# EAGLE design bp1 (EAGLE 6.5.0)
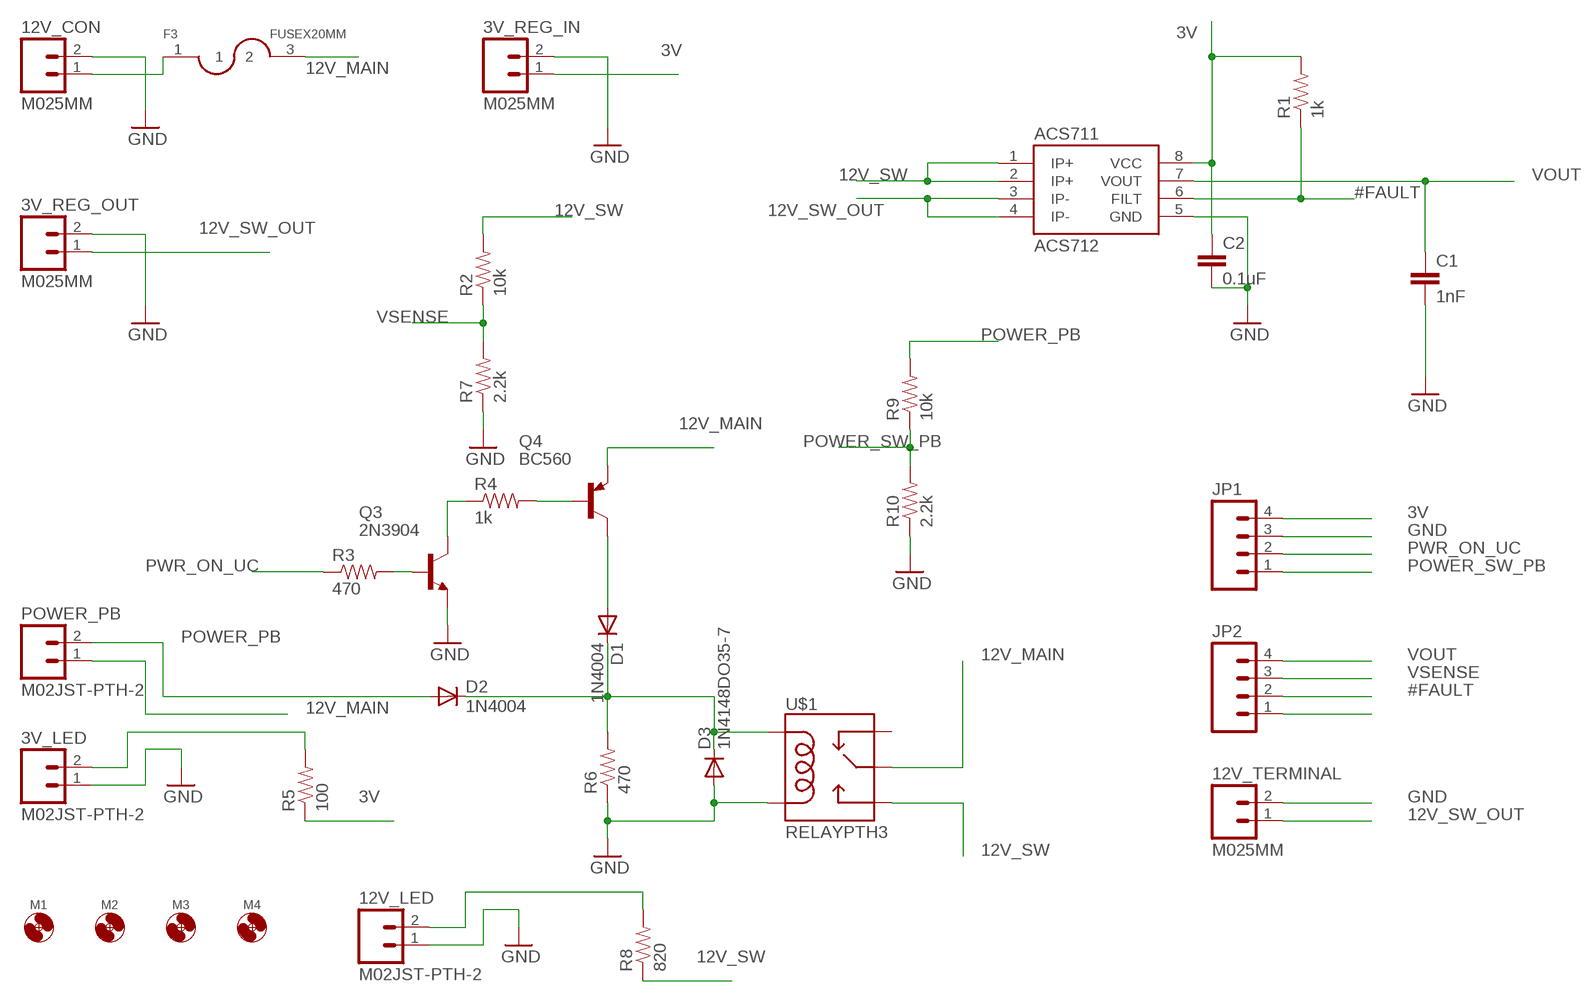
[diagram p0: schematic, sheet 1]

## Parts
3V_LED  M02JST-PTH-2  [JST-2-PTH]
3V_REG_IN  M025MM  [SCREWTERMINAL-5MM-2]
3V_REG_OUT  M025MM  [SCREWTERMINAL-5MM-2]
12V_CON  M025MM  [SCREWTERMINAL-5MM-2]
12V_LED  M02JST-PTH-2  [JST-2-PTH]
12V_TERMINAL  M025MM  [SCREWTERMINAL-5MM-2]
ACS711  ACS712  [SO08]
C1  1nF  CAPKIT  [CAP-PTH-SMALL-KIT]
C2  0.1uF  CAPKIT  [CAP-PTH-SMALL-KIT]
D1  1N4004  [DO41-10]
D2  1N4004  [DO41-10]
D3  1N4148DO35-7  [DO35-7]
F3  FUSEX20MM  [FUSE_5MM]
JP1  M04POLAR  [MOLEX-1X4]
JP2  M04POLAR  [MOLEX-1X4]
M1  MOUNT-HOLE3.0  [3,0]
M2  MOUNT-HOLE3.0  [3,0]
M3  MOUNT-HOLE3.0  [3,0]
M4  MOUNT-HOLE3.0  [3,0]
POWER_PB  M02JST-PTH-2  [JST-2-PTH]
Q3  2N3904  [TO92]
Q4  BC560  [TO92-EBC]
R1  1k  RESISTORPTH-1/4W  [AXIAL-0.4]
R2  10k  RESISTORPTH-1/4W  [AXIAL-0.4]
R3  470  RESISTORPTH-1/4W  [AXIAL-0.4]
R4  1k  RESISTORPTH-1/4W  [AXIAL-0.4]
R5  100  RESISTORPTH-1/4W  [AXIAL-0.4]
R6  470  RESISTORPTH-1/4W  [AXIAL-0.4]
R7  2.2k  RESISTORPTH-1/4W  [AXIAL-0.4]
R8  820  RESISTORPTH-1/4W  [AXIAL-0.4]
R9  10k  RESISTORPTH-1/4W  [AXIAL-0.4]
R10  2.2k  RESISTORPTH-1/4W  [AXIAL-0.4]
U$1  RELAYPTH3  [RELAY-T9A-2]

## Nets
3V: 3V_REG_IN.1 ACS711.8(VCC) C2.1 JP1.4 R1.P$2 R5.P$1
12V_MAIN: F3.3 POWER_PB.1 Q4.E U$1.MAIN
12V_SW: ACS711.1(IP+) ACS711.2(IP+) R2.P$2 R8.P$1 U$1.NO
12V_SW_OUT: 3V_REG_OUT.1 12V_TERMINAL.1 ACS711.3(IP-) ACS711.4(IP-)
#FAULT: ACS711.6(FILT) JP2.2 R1.P$1
GND: 3V_LED.1 3V_REG_IN.2 3V_REG_OUT.2 12V_CON.2 12V_LED.1 12V_TERMINAL.2 ACS711.5(GND) C1.2 C2.2 D3.A JP1.3 Q3.3(E) R6.P$1 R7.P$1 R10.P$1 U$1.COIL2
N$1: 12V_LED.2 R8.P$2
N$2: 12V_CON.1 F3.1
N$9: Q3.1(C) R4.P$1
N$10: Q4.B R4.P$2
N$11: Q3.2(B) R3.P$2
N$12: D1.A Q4.C
N$13: D1.C D2.C D3.C R6.P$2 U$1.COIL1
N$15: 3V_LED.2 R5.P$2
N$16: JP2.1
POWER_PB: D2.A POWER_PB.2 R9.P$2
POWER_SW_PB: JP1.1 R9.P$1 R10.P$2
PWR_ON_UC: JP1.2 R3.P$1
VOUT: ACS711.7(VOUT) C1.1 JP2.4
VSENSE: JP2.3 R2.P$1 R7.P$2
Unconnected: U$1.NC

## Library data of the parts
3V_LED 12V_LED POWER_PB = SparkFun-Connectors:M02: Standard 2-pin 0.1" header. Use with - straight break away headers ( PRT-00116) - right angle break away headers (PRT-00553) - swiss pins (PRT-00743) - machine pins (PRT-00117) - female headers (PRT-00115) Molex polarized connector foot print use with: PRT-08233 with associated crimp pins and housings. 2.54_SCREWTERM for use with PRT-10571. 3.5mm Screw Terminal footprints for PRT-08084 5mm Screw Terminal footprints for use with PRT-08433; SKU: PRT-09914
3V_REG_IN 3V_REG_OUT 12V_CON 12V_TERMINAL = SparkFun-Connectors:M02: Standard 2-pin 0.1" header. Use with - straight break away headers ( PRT-00116) - right angle break away headers (PRT-00553) - swiss pins (PRT-00743) - machine pins (PRT-00117) - female headers (PRT-00115) Molex polarized connector foot print use with: PRT-08233 with associated crimp pins and housings. 2.54_SCREWTERM for use with PRT-10571. 3.5mm Screw Terminal footprints for PRT-08084 5mm Screw Terminal footprints for use with PRT-08433
ACS711 = SparkFun-AnalogIC:ACS712: Hall-effect-based isolated linear current sensor
C1 C2 = SparkFun-Capacitors:CAP: Capacitor Standard 0603 ceramic capacitor, and 0.1" leaded capacitor.
D1 D2 = diode:1N4004: DIODE general purpose rectifier, 1 A
D3 = diode:1N4148: DIODE high speed (Philips)
F3 = SparkFun-Passives:FUSE
JP1 JP2 = SparkFun-Connectors:M04: Header 4 Standard 4-pin 0.1" header. Use with straight break away headers (SKU : PRT-00116), right angle break away headers (PRT-00553), swiss pins (PRT-00743), machine pins (PRT-00117), and female headers (PRT-00115). Molex polarized connector foot print use with SKU : PRT-08231 with associated crimp pins and housings. 1MM SMD Version SKU: PRT-10208
M1-M4 = PowerBoard:MOUNT-HOLE: MOUNTING HOLE with drill center marker
Q3 = transistor-npn:2N3904: NPN Transistor
Q4 = transistor-pnp:BC560*: PNP Transistror
R1-R10 = SparkFun-Passives:RESISTOR: Resistor Basic schematic elements and footprints for 0603, 1206, and PTH resistors.
U$1 = SparkFun-Electromechanical:RELAY: SPDT relay (COM-00101)

## Board
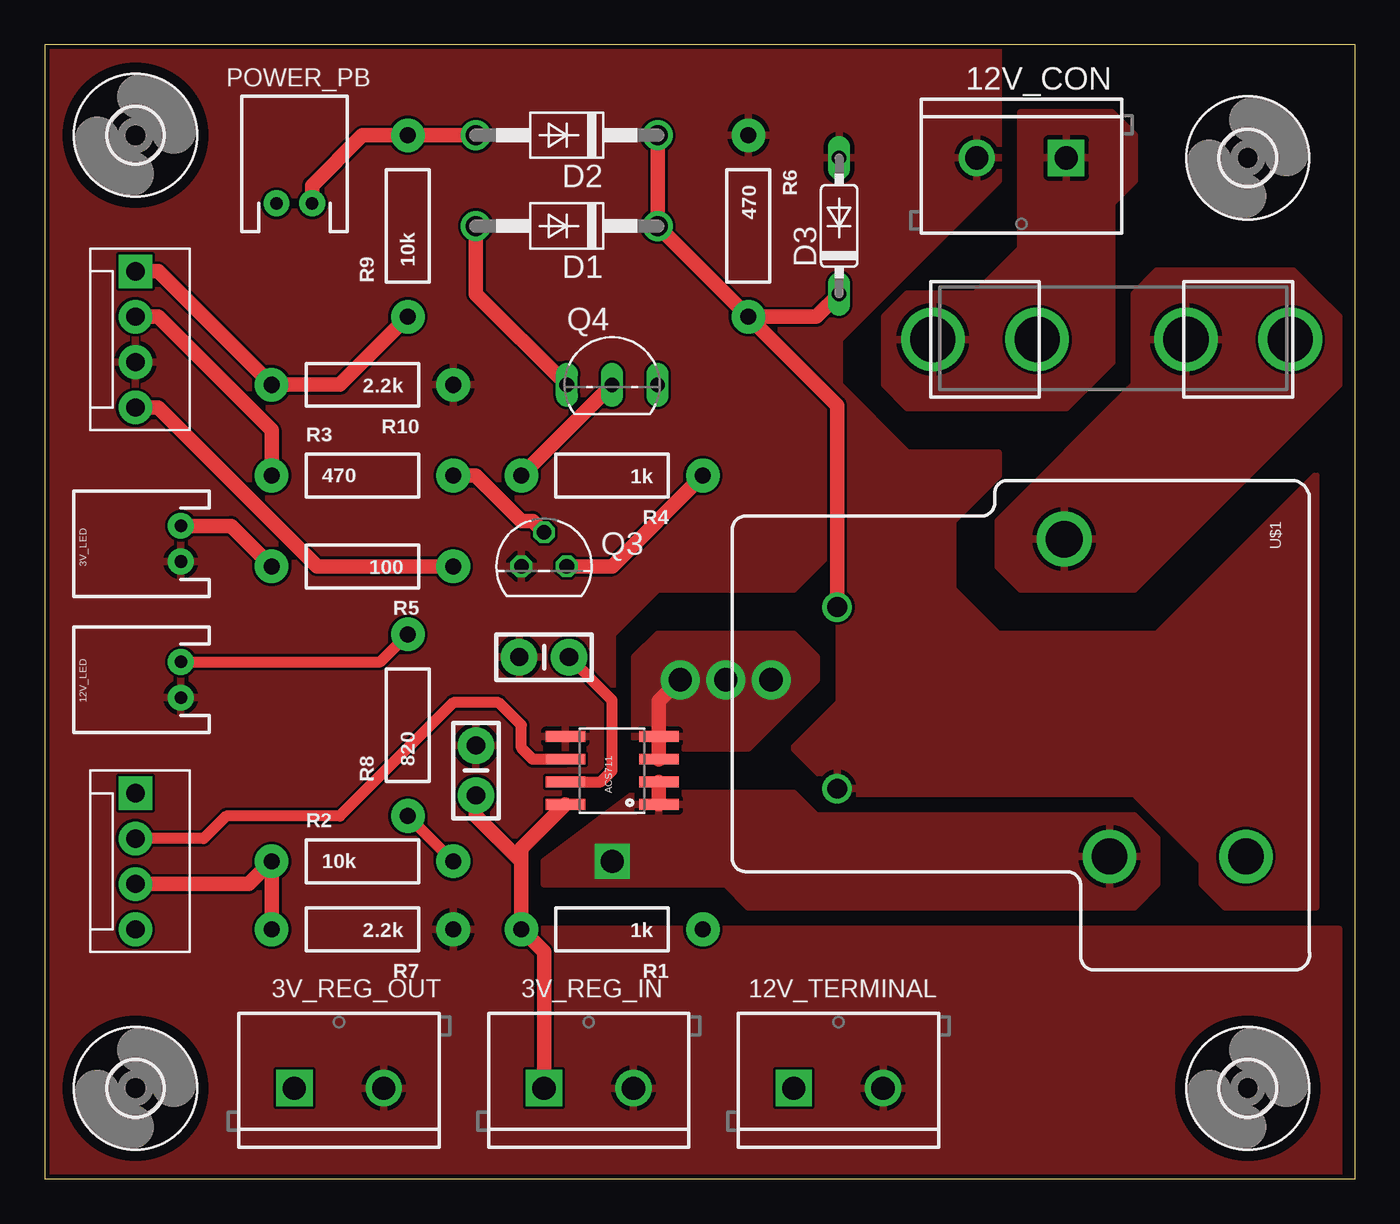
[diagram p1: board, top side]
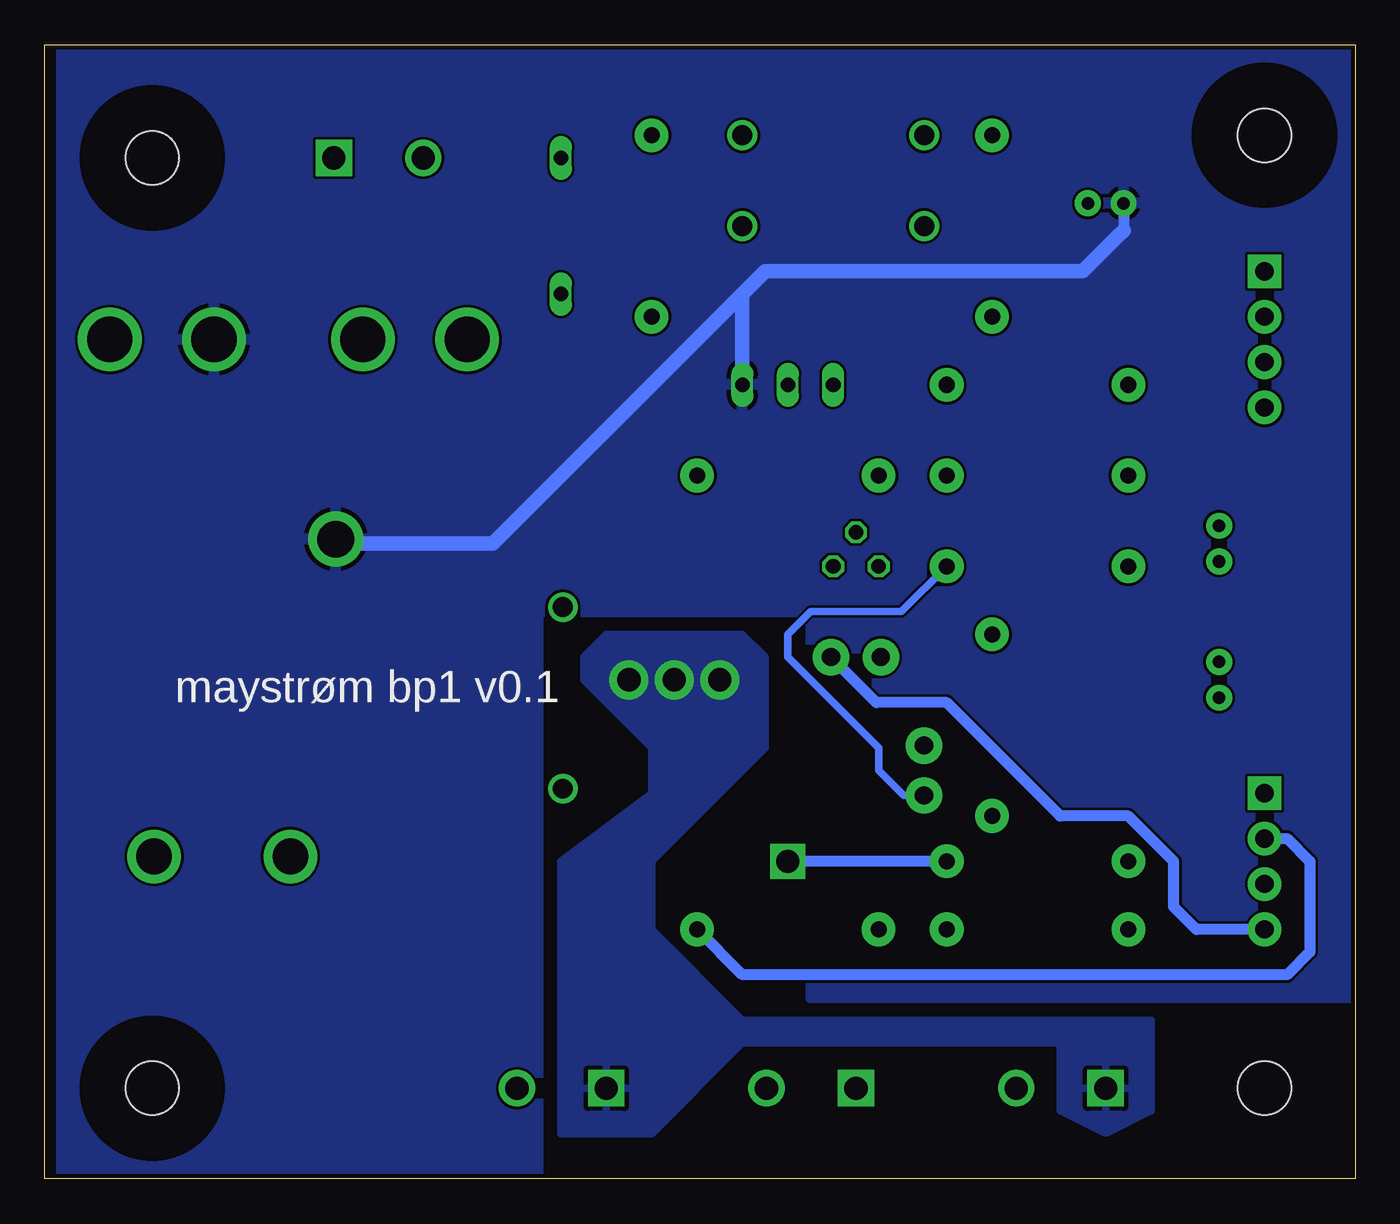
[diagram p2: board, bottom side, seen from below]

Size 73.33 x 63.49 mm. Coordinates in mm from the lower left corner, seen from the top.
Outline: 0,0 73.33,0 73.33,63.49 0,63.49 0,0
Copper layers (1*2*15*16): Top 0.035mm / dielectric 0.2mm / layer 2 0.0175mm / dielectric 1.1mm / layer 15 0.0175mm / dielectric 0.2mm / Bottom 0.035mm
Design rules "SeeedStudio_DRU_no_angle_20130527": minimum track width 6mil, minimum drill 12mil, track to track 6mil, track to pad 6mil, pad to pad 6mil, via to via 6mil, smd to smd 0mil, copper to edge 10mil, drill to drill 10mil, minimum pad ring 6mil, minimum via ring 6mil, stop-mask expansion 2mil, vias tented up to drill 25mil, thermal gap 10mil

### Footprints (pad centres in the part's own frame; a part is rotated, then mirrored left to right if it is on the bottom)
JST-2-PTH = drill 0.7 pad 1.448: 1 -1,0; 2 1,0
SCREWTERMINAL-5MM-2 = drill 1.3 pad 2.032 square: 1 0,0 | drill 1.3 pad 2.032: 2 5,0
SO08 = smd 0.61 x 2.21: 1 -1.905,-2.616; 2 -0.635,-2.616; 3 0.635,-2.616; 4 1.905,-2.616; 5 1.905,2.616; 6 0.635,2.616; 7 -0.635,2.616; 8 -1.905,2.616
CAP-PTH-SMALL-KIT = drill 1.016 pad 2.032: 1 -1.397,0; 2 1.397,0
DO41-10 = drill 1.118: A 5.08,0; C -5.08,0
DO35-7 = drill 0.813 long: A 3.81,0; C -3.81,0
FUSE_5MM = drill 2.54 pad 3.556: 1 0,-10; 2 0,-4.158; 3 0,4.158; 4 0,10
MOLEX-1X4 = drill 1.016 pad 1.88 square: 1 0,0 | drill 1.016 pad 1.88: 2 2.54,0; 3 5.08,0; 4 7.62,0
3,0 = hole 3: 0,0
TO92 = drill 0.813 octagon: 1 1.27,0; 2 0,1.905; 3 -1.27,0
TO92-EBC = drill 0.813 long: B 0,-1.27; C -2.54,-1.27; E 2.54,-1.27
AXIAL-0.4 = drill 0.9 pad 1.88: P$1 -5.08,0; P$2 5.08,0
RELAY-T9A-2 = drill 1.1: COIL1 -6.61,-10.27; COIL2 3.55,-10.27 | drill 2.057: MAIN -10.41,2.43 | drill 2: NC 7.35,12.6; NO 7.35,4.97

### Placement (x,y rotation side)
3V_LED  7.62,35.56 90 top
3V_REG_IN  27.94,5.08 0 top
3V_REG_OUT  13.97,5.08 0 top
12V_CON  57.15,57.15 180 top
12V_LED  7.62,27.94 90 top
12V_TERMINAL  41.91,5.08 0 top
ACS711  31.75,22.86 90 top
C1  27.94,29.21 180 top
C2  24.13,22.86 90 top
D1  29.21,53.34 180 top
D2  29.21,58.42 180 top
D3  44.45,53.34 90 top
F3  59.69,46.99 270 top
JP1  5.08,50.8 270 top
JP2  5.08,21.59 270 top
M1  5.08,5.08 0 top
M2  67.31,5.08 0 top
M3  67.31,57.15 0 top
M4  5.08,58.42 0 top
POWER_PB  13.97,54.61 0 top
Q3  27.94,34.29 0 top
Q4  31.75,45.72 0 top
R1  31.75,13.97 180 top
R2  17.78,17.78 0 top
R3  17.78,39.37 0 top
R4  31.75,39.37 180 top
R5  17.78,34.29 180 top
R6  39.37,53.34 270 top
R7  17.78,13.97 180 top
R8  20.32,25.4 90 top
R9  20.32,53.34 90 top
R10  17.78,44.45 180 top
U$1  54.61,25.4 270 top

### Tracks (layer width: path | path; a pad name or v marks a point on that pad's centre or on a via)
3V
  Top 0.813: R5.P$1 15.24,34.29 6.35,43.18 JP1.4 | 3V_REG_IN.1 27.94,12.7 R1.P$2 26.67,17.78 | 26.67,17.78 26.67,18.49 ACS711.8 | C2.1 24.13,20.32 26.67,17.78
  Bottom 0.406: C2.1 25.27,21.46 26.67,22.86 26.67,24.13 31.75,29.21 31.75,30.48 30.48,31.75 25.4,31.75 R5.P$1
12V_MAIN
  Bottom 0.61: POWER_PB.1 12.97,53.07
  Bottom 0.813: 12.97,53.07 13.34,52.7 15.24,50.8 33.02,50.8 34.29,49.53 | 34.29,49.53 48.26,35.56 56.79,35.56 U$1.MAIN | Q4.E 34.29,49.53
  pour Top: 60.96,49.53 62.23,50.8 69.85,50.8 71.12,49.53 72.39,48.26 72.39,44.45 71.12,43.18 60.96,33.02 54.61,33.02 53.34,34.29 53.34,36.83 60.96,44.45
  pour Bottom: 0,63.5 72.39,63.5 72.39,0 45.72,0 45.72,30.48 45.72,31.75 30.48,31.75 30.48,10.16 0,10.16
12V_SW  (via drill 1.3)
  Top 0.61: R8.P$1 R2.P$2
  Top 0.813: ACS711.2 ACS711.1
  Bottom 0.61: R2.P$2 v31.75,17.78
  pour Top: 33.02,21.59 41.91,21.59 43.18,20.32 60.96,20.32 62.23,19.05 62.23,16.51 60.96,15.24 39.37,15.24 38.1,16.51 27.94,16.51 27.94,17.78
12V_SW_OUT  (via drill 1.3 pad 2.18)
  Top 0.813: ACS711.3 34.37,26.75 v35.56,27.94
  other vias: 38.1,27.94 40.64,27.94
  pour Top: 33.02,24.13 39.37,24.13 43.18,27.94 43.18,29.21 41.91,30.48 34.29,30.48 33.02,29.21
  pour Bottom: 11.43,3.81 11.43,8.89 34.29,8.89 39.37,13.97 39.37,17.78 33.02,24.13 33.02,29.21 34.29,30.48 41.91,30.48 43.18,29.21 43.18,27.94 39.37,24.13 39.37,21.59 44.45,17.78 44.45,2.54 39.37,2.54 34.29,7.62 16.51,7.62 16.51,3.81 13.97,2.54
#FAULT
  Top 0.61: ACS711.6 27.3,23.5 26.67,24.13 26.67,25.4 25.4,26.67 22.86,26.67 16.51,20.32 10.16,20.32 8.89,19.05 JP2.2
  Bottom 0.61: JP2.2 3.81,19.05 2.54,17.78 2.54,12.7 3.81,11.43 34.29,11.43 R1.P$1
GND
  pour Top: 0,63.5 0,0 72.39,0 72.39,13.97 27.94,13.97 26.67,15.24 26.67,17.78 31.75,22.86 31.75,30.48 34.29,33.02 41.91,33.02 44.45,35.56 44.45,26.67 41.91,24.13 44.45,21.59 60.96,21.59 64.77,17.78 64.77,16.51 66.04,15.24 71.12,15.24 71.12,39.37 62.23,30.48 53.34,30.48 50.8,33.02 50.8,36.83 53.34,39.37 53.34,40.64 48.26,40.64 44.45,44.45 44.45,46.99 53.34,55.88 53.34,63.5
N$1
  Top 0.61: 12V_LED.2 18.78,28.94 R8.P$2
N$2
  pour Top: 54.61,59.69 59.69,59.69 60.96,58.42 60.96,55.88 59.69,54.61 59.69,45.72 57.15,43.18 48.26,43.18 46.99,44.45 46.99,48.26 48.26,49.53 52.07,49.53 54.61,52.07
N$9
  Top 0.813: Q3.1 31.75,34.29 R4.P$1
N$10
  Top 0.813: R4.P$2 Q4.B
N$11
  Top 0.813: R3.P$2 24.13,39.37 26.67,36.83 27.3,36.83 Q3.2
N$12
  Top 0.813: D1.A 24.13,49.53 Q4.C
N$13
  Top 0.813: D2.C D1.C R6.P$2 | R6.P$2 43.18,48.26 D3.C | U$1.COIL1 44.34,43.29 R6.P$2
N$15
  Top 0.813: 3V_LED.2 10.43,36.56 R5.P$2
POWER_PB
  Top 0.813: POWER_PB.2 14.97,55.61 17.78,58.42 R9.P$2 D2.A
POWER_SW_PB
  Top 0.813: JP1.1 6.35,50.8 R10.P$2 16.51,44.45 R9.P$1
PWR_ON_UC
  Top 0.813: JP1.2 6.35,48.26 12.7,41.91 R3.P$1
VOUT
  Top 0.61: ACS711.7 31.11,22.23 31.75,22.86 31.75,26.8 C1.1
  Bottom 0.61: JP2.4 8.89,13.97 10.16,15.24 10.16,17.78 12.7,20.32 16.51,20.32 22.86,26.67 26.8,26.67 C1.1
VSENSE
  Top 0.813: JP2.3 11.43,16.51 R2.P$1 R7.P$2

### Text on the board
bNames: maystrøm bp1 v0.1